# EAGLE schematic werkstatt-exp (EAGLE 9.6.2)
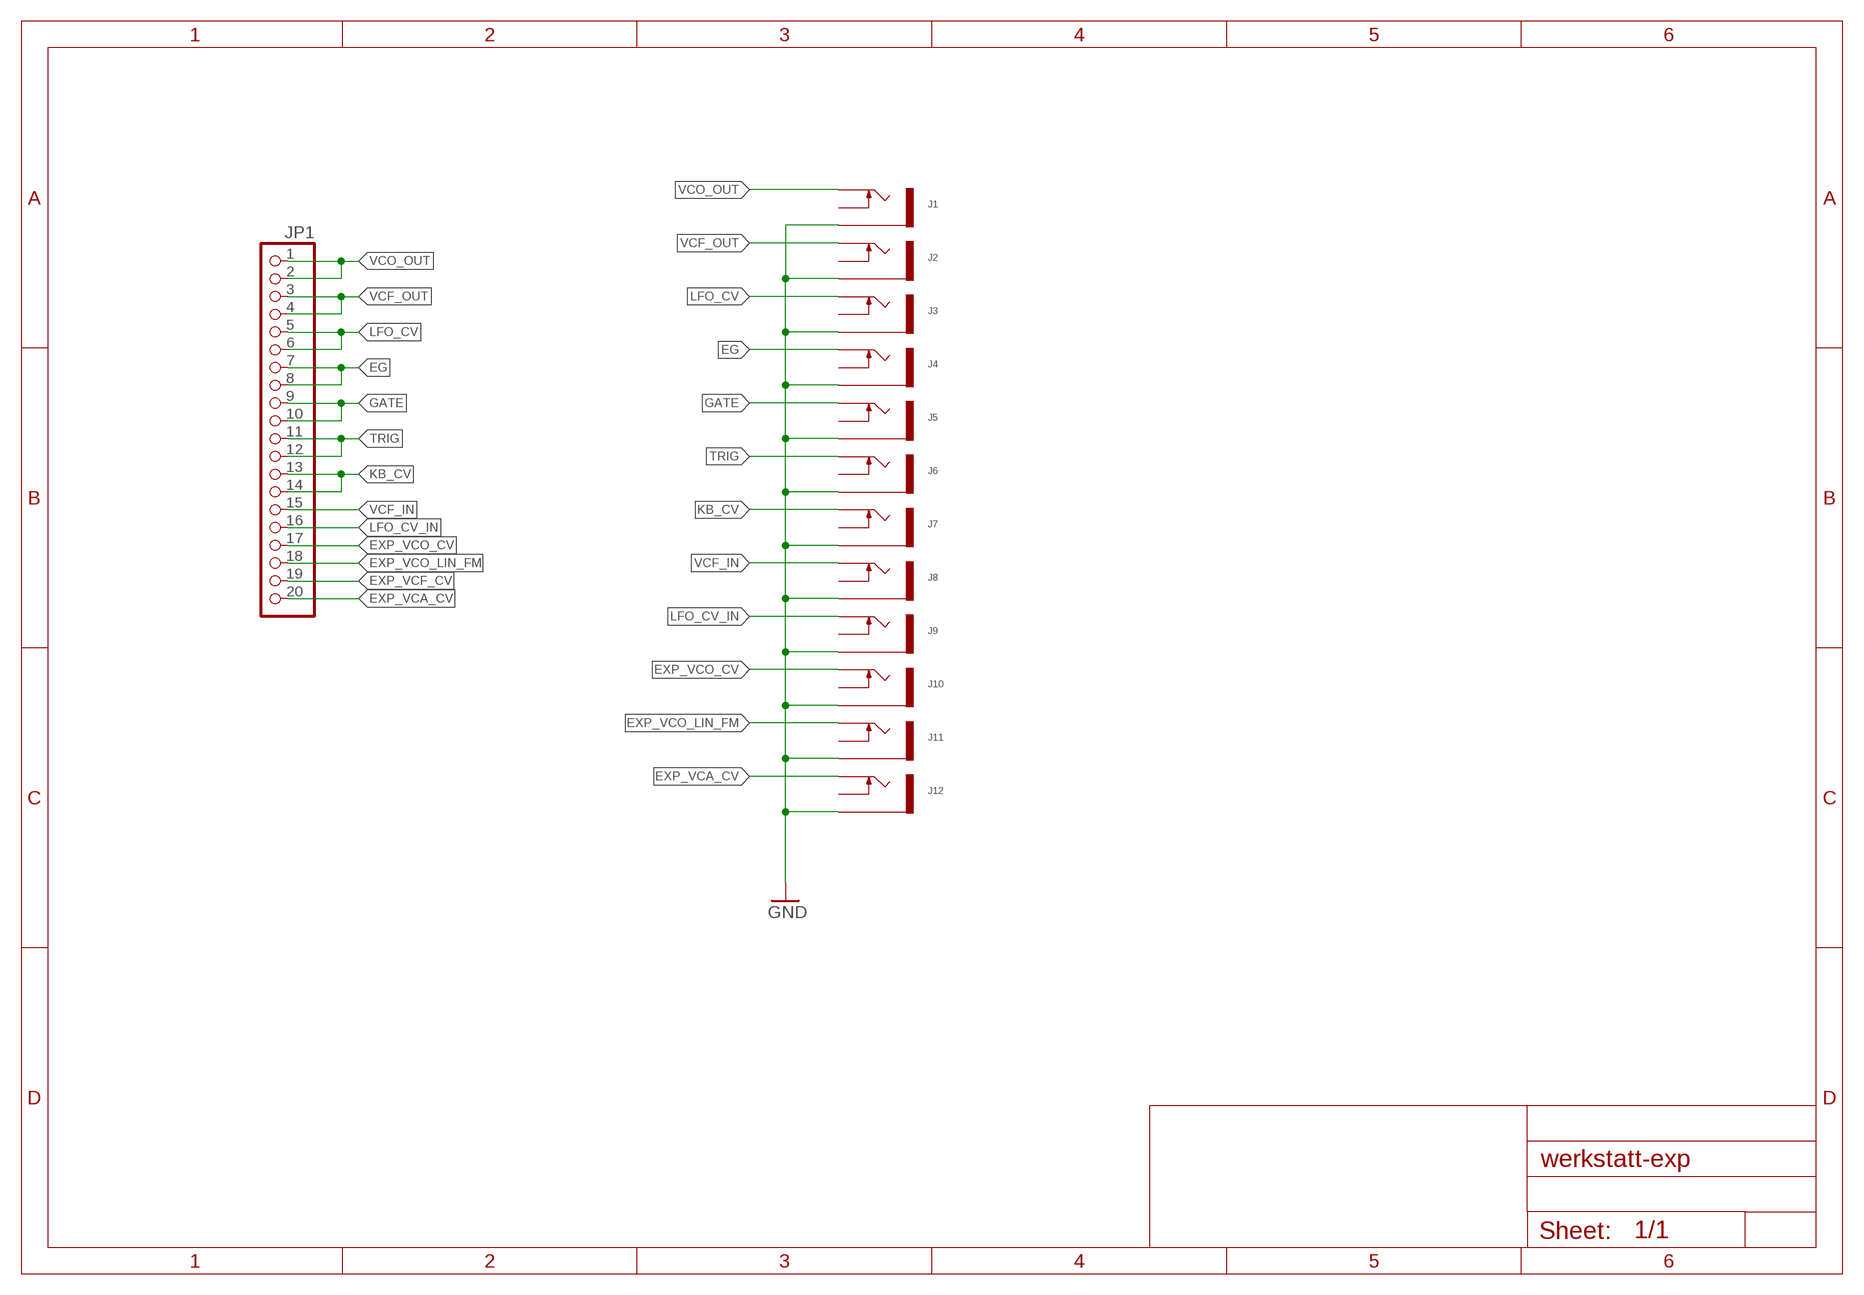
[diagram p0: schematic, sheet 1]

## Parts
J1  THONKICON  [WQP-PJ301M-12_JACK]
J2  THONKICON  [WQP-PJ301M-12_JACK]
J3  THONKICON  [WQP-PJ301M-12_JACK]
J4  THONKICON  [WQP-PJ301M-12_JACK]
J5  THONKICON  [WQP-PJ301M-12_JACK]
J6  THONKICON  [WQP-PJ301M-12_JACK]
J7  THONKICON  [WQP-PJ301M-12_JACK]
J8  THONKICON  [WQP-PJ301M-12_JACK]
J9  THONKICON  [WQP-PJ301M-12_JACK]
J10  THONKICON  [WQP-PJ301M-12_JACK]
J11  THONKICON  [WQP-PJ301M-12_JACK]
J12  THONKICON  [WQP-PJ301M-12_JACK]
JP1  PINHD-1X20  [1X20]

## Nets
EG: J4.3 JP1.7 JP1.8
EXP_VCA_CV: J12.3 JP1.20
EXP_VCF_CV: JP1.19
EXP_VCO_CV: J10.3 JP1.17
EXP_VCO_LIN_FM: J11.3 JP1.18
GATE: J5.3 JP1.9 JP1.10
GND: J1.1 J2.1 J3.1 J4.1 J5.1 J6.1 J7.1 J8.1 J9.1 J10.1 J11.1 J12.1
KB_CV: J7.3 JP1.13 JP1.14
LFO_CV: J3.3 JP1.5 JP1.6
LFO_CV_IN: J9.3 JP1.16
TRIG: J6.3 JP1.11 JP1.12
VCF_IN: J8.3 JP1.15
VCF_OUT: J2.3 JP1.3 JP1.4
VCO_OUT: J1.3 JP1.1 JP1.2
Unconnected: J1.2 J2.2 J3.2 J4.2 J5.2 J6.2 J7.2 J8.2 J9.2 J10.2 J11.2 J12.2

## Library data of the parts
J1-J12 = thonkiconn:THONKICON
JP1 = pinhead:PINHD-1X20: PIN HEADER